# EAGLE design plugFeather (EAGLE 9.2.2)
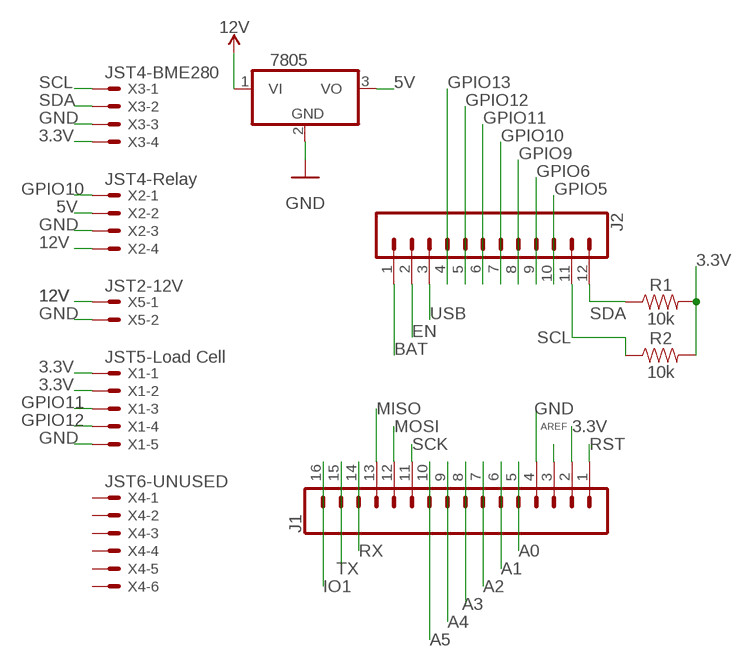
[diagram p0: schematic, sheet 1]

## Parts
IC1  7805  7805TV  [TO220V]
J1  CONN_16  [1X16]
J2  CONN_12  [1X12]
R1  10k  10KOHM-HORIZ-1/4W-5%  [AXIAL-0.3]
R2  10k  10KOHM-HORIZ-1/4W-5%  [AXIAL-0.3]
X1  JST5-Load Cell  JST-XH-05-PIN-LONG-PAD  [JST-XH-05-PACKAGE-LONG-PAD]
X2  JST4-Relay  JST-XH-04-PIN-LONG-PAD  [JST-XH-04-PACKAGE-LONG-PAD]
X3  JST4-BME280  JST-XH-04-PIN-LONG-PAD  [JST-XH-04-PACKAGE-LONG-PAD]
X4  JST6-UNUSED  JST-XH-06-PIN-LONG-PAD  [JST-XH-06-PACKAGE-LONG-PAD]
X5  JST2-12V  JST-XH-02-PIN-LONG-PAD  [JST-XH-02-PACKAGE-LONG-PAD]

## Nets
3.3V: J1.2 R1.P$2 R2.P$2 X1.1 X1.2 X3.4
5V: IC1.3(VO) X2.2
12V: IC1.1(VI) X2.4 X5.1
A0: J1.5
A1: J1.6
A2: J1.7
A3: J1.8
A4: J1.9
A5: J1.10
AREF: J1.3
BAT: J2.1
EN: J2.2
GND: IC1.2(GND) J1.4 X1.5 X2.3 X3.3 X5.2
GPIO5: J2.10
GPIO6: J2.9
GPIO9: J2.8
GPIO10: J2.7 X2.1
GPIO11: J2.6 X1.3
GPIO12: J2.5 X1.4
GPIO13: J2.4
IO1: J1.16
MISO: J1.13
MOSI: J1.12
RST: J1.1
RX: J1.14
SCK: J1.11
SCL: J2.11 R2.P$1 X3.1
SDA: J2.12 R1.P$1 X3.2
TX: J1.15
USB: J2.3
Unconnected: X4.1 X4.2 X4.3 X4.4 X4.5 X4.6

## Library data of the parts
IC1 = linear:78*: Positive VOLTAGE REGULATOR Source: http://cache.national.com/ds/LM/LM78L05.pdf http://www.fairchildsemi.com/ds/LM/LM7805.pdf
J1 = SparkFun-Connectors:CONN_16: Multi connection point. Often used as Generic Header-pin footprint for 0.1 inch spaced/style header connections On any of the 0.1 inch spaced packages, you can populate with these: Break Away Headers - Straight <https://www.sparkfun.com/products/116> (PRT-00116) Break Away Male Headers - Right Angle <https://www.sparkfun.com/products/553> (PRT-00553) Female Headers <https://www.sparkfun.com/products/115> (PRT-00115) Break Away Headers - Machine Pin <https://www.sparkfun.com/products/117> (PRT-00117) Break Away Female Headers - Swiss Machine Pin <https://www.sparkfun.com/products/743> (PRT-00743) For SCREWTERMINALS and SPRING TERMINALS visit here: Screw Terimnals on SparkFun.com <https://www.sparkfun.com/search/results?term=Screw+Terminals> (5mm/3.5mm/2.54mm spacing) This device is also useful as a general connection point to wire up your design to another part of your project. Our various solder wires solder well into these plated through hole pads. Hook-Up Wire - Assortment (Stranded, 22 AWG) <https://www.sparkfun.com/products/11375> (PRT-11375) Hook-Up Wire - Assortment (Solid Core, 22 AWG) <https://www.sparkfun.com/products/11367> (PRT-11367) View the entire wire category on our website here <https://www.sparkfun.com/categories/141> Special notes: Molex polarized connector foot print use with SKU : PRT-08231 with associated crimp pins and housings. 1MM SMD Version SKU: PRT-10208 NOTES ON THE VARIANTS LOCK and LOCK_LONGPADS... This footprint was designed to help hold the alignment of a through-hole component (i.e. 6-pin header) while soldering it into place. You may notice that each hole has been shifted either up or down by 0.005 of an inch from it's more standard position (which is a perfectly straight line). This slight alteration caused the pins (the squares in the middle) to touch the edges of the holes. Because they are alternating, it causes a "brace" to hold the component in place. 0.005 has proven to be the perfect amount of "off-center" position when using our standard breakaway headers. Although looks a little odd when you look at the bare footprint, once you have a header in there, the alteration is very hard to notice. Also,if you push a header all the way into place, it is covered up entirely on the bottom side.
J2 = SparkFun-Connectors:CONN_12: Multi connection point. Often used as Generic Header-pin footprint for 0.1 inch spaced/style header connections On any of the 0.1 inch spaced packages, you can populate with these: Break Away Headers - Straight <https://www.sparkfun.com/products/116> (PRT-00116) Break Away Male Headers - Right Angle <https://www.sparkfun.com/products/553> (PRT-00553) Female Headers <https://www.sparkfun.com/products/115> (PRT-00115) Break Away Headers - Machine Pin <https://www.sparkfun.com/products/117> (PRT-00117) Break Away Female Headers - Swiss Machine Pin <https://www.sparkfun.com/products/743> (PRT-00743) For SCREWTERMINALS and SPRING TERMINALS visit here: Screw Terimnals on SparkFun.com <https://www.sparkfun.com/search/results?term=Screw+Terminals> (5mm/3.5mm/2.54mm spacing) This device is also useful as a general connection point to wire up your design to another part of your project. Our various solder wires solder well into these plated through hole pads. Hook-Up Wire - Assortment (Stranded, 22 AWG) <https://www.sparkfun.com/products/11375> (PRT-11375) Hook-Up Wire - Assortment (Solid Core, 22 AWG) <https://www.sparkfun.com/products/11367> (PRT-11367) View the entire wire category on our website here <https://www.sparkfun.com/categories/141> Special notes: Molex polarized connector foot print use with SKU : PRT-08231 with associated crimp pins and housings. 1MM SMD Version SKU: PRT-10208 NOTES ON THE VARIANTS LOCK and LOCK_LONGPADS... This footprint was designed to help hold the alignment of a through-hole component (i.e. 6-pin header) while soldering it into place. You may notice that each hole has been shifted either up or down by 0.005 of an inch from it's more standard position (which is a perfectly straight line). This slight alteration caused the pins (the squares in the middle) to touch the edges of the holes. Because they are alternating, it causes a "brace" to hold the component in place. 0.005 has proven to be the perfect amount of "off-center" position when using our standard breakaway headers. Although looks a little odd when you look at the bare footprint, once you have a header in there, the alteration is very hard to notice. Also,if you push a header all the way into place, it is covered up entirely on the bottom side.
R1 R2 = SparkFun-Resistors:10KOHM: 10kΩ resistor A resistor is a passive two-terminal electrical component that implements electrical resistance as a circuit element. Resistors act to reduce current flow, and, at the same time, act to lower voltage levels within circuits. - Wikipedia; PROD_ID: RES-09435
X1 = JST XH Connectors v1-0:JST-XH-05-PIN: JST XH Connector 2 Pin Wire to board connector. Pitch: 2,54 mm, (0.100") Number of pins: 5 Created by Rembrandt Electronics www.rembrandtelectronics.com
X2 X3 = JST XH Connectors v1-0:JST-XH-04-PIN: JST XH Connector 2 Pin Wire to board connector. Pitch: 2,54 mm, (0.100") Number of pins: 4 Created by Rembrandt Electronics www.rembrandtelectronics.com
X4 = JST XH Connectors v1-0:JST-XH-06-PIN: JST XH Connector 2 Pin Wire to board connector. Pitch: 2,54 mm, (0.100") Number of pins: 6 Created by Rembrandt Electronics www.rembrandtelectronics.com
X5 = JST XH Connectors v1-0:JST-XH-02-PIN: JST XH Connector 2 Pin Wire to board connector. Pitch: 2,54 mm, (0.100") Number of pins: 2 Created by Rembrandt Electronics www.rembrandtelectronics.com

## Board
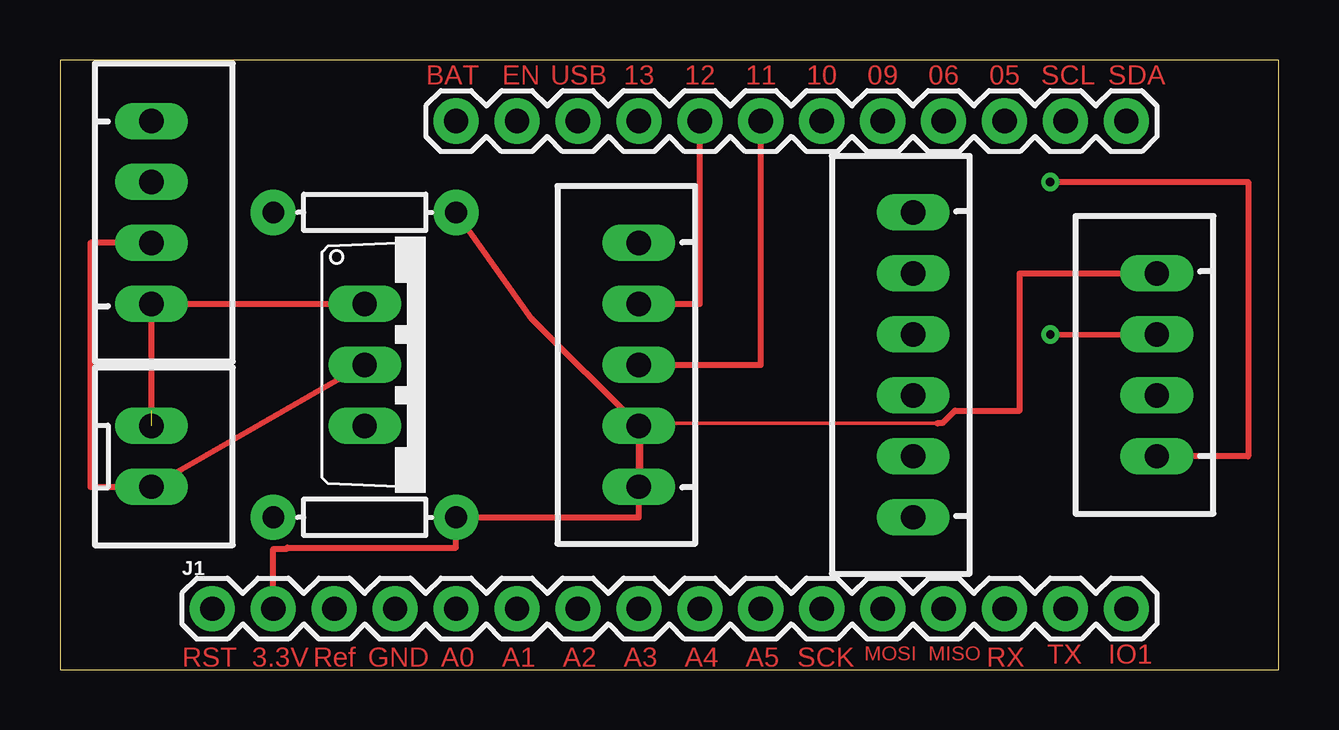
[diagram p1: board, top side]
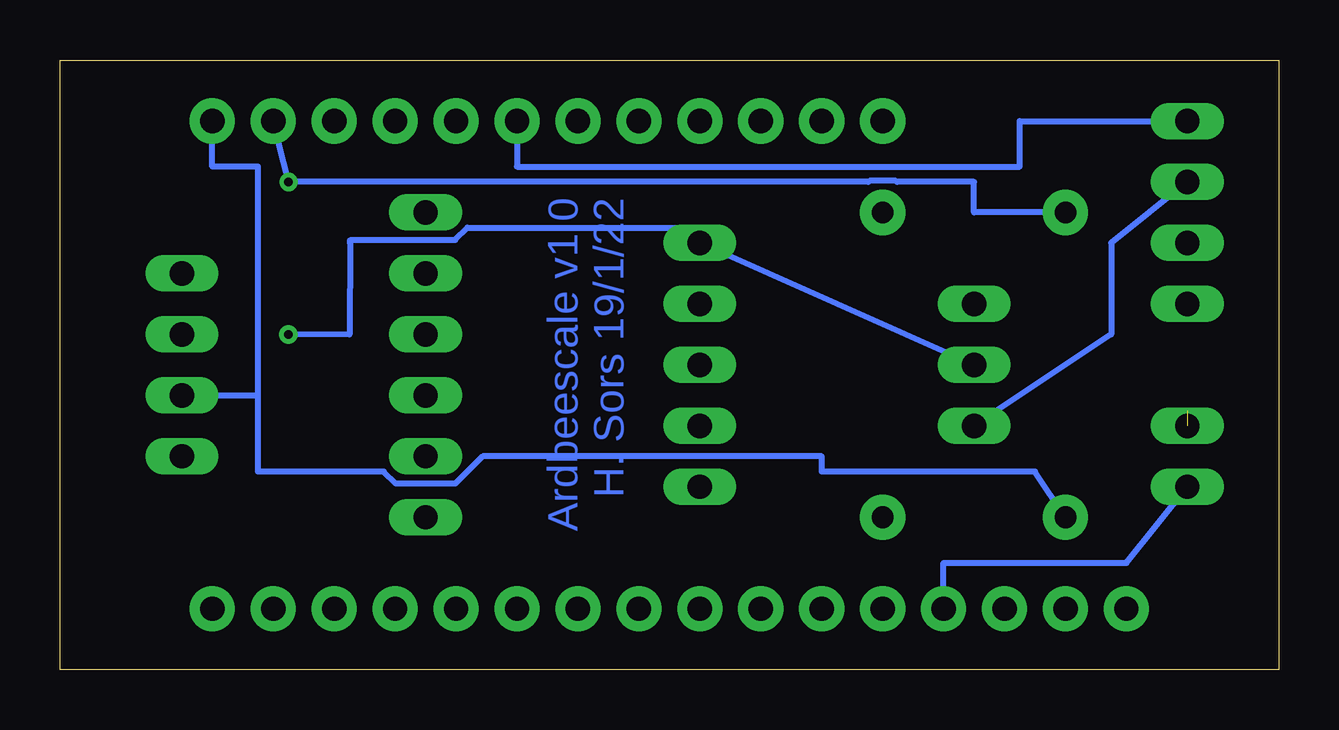
[diagram p2: board, bottom side, seen from below]

Size 50.8 x 25.4 mm. Coordinates in mm from the lower left corner, seen from the top.
Outline: 0,0 50.8,0.01 50.8,25.4 0,25.4 0,0
Copper layers (1*16): Top 0.035mm / dielectric 1.5mm / Bottom 0.035mm
Design rules "default *": minimum track width 10mil, minimum drill 0.35mm, track to track 6mil, track to pad 10mil, pad to pad 10mil, via to via 10mil, smd to smd 6mil, copper to edge 40mil, drill to drill 6mil, minimum pad ring 10mil, minimum via ring 8mil, stop-mask expansion 4mil, vias tented up to drill 0mil, thermal gap 10mil

### Footprints (pad centres in the part's own frame; a part is rotated, then mirrored left to right if it is on the bottom)
TO220V = drill 1.016 long: 1 -2.54,-2.54; 2 0,-2.54; 3 2.54,-2.54
1X16 = drill 1.016 pad 1.88: 1 0,0; 2 2.54,0; 3 5.08,0; 4 7.62,0; 5 10.16,0; 6 12.7,0; 7 15.24,0; 8 17.78,0; 9 20.32,0; 10 22.86,0; 11 25.4,0; 12 27.94,0; 13 30.48,0; 14 33.02,0; 15 35.56,0; 16 38.1,0
1X12 = drill 1.016 pad 1.88: 1 0,0; 2 2.54,0; 3 5.08,0; 4 7.62,0; 5 10.16,0; 6 12.7,0; 7 15.24,0; 8 17.78,0; 9 20.32,0; 10 22.86,0; 11 25.4,0; 12 27.94,0
AXIAL-0.3 = drill 0.9 pad 1.88: P$1 -3.81,0; P$2 3.81,0
JST-XH-05-PACKAGE-LONG-PAD = drill 1.016 long: 1 -5.08,0; 2 -2.54,0; 3 0,0; 4 2.54,0; 5 5.08,0
JST-XH-04-PACKAGE-LONG-PAD = drill 1.016 long: 1 -3.81,0; 2 -1.27,0; 3 1.27,0; 4 3.81,0
JST-XH-06-PACKAGE-LONG-PAD = drill 1.016 long: 1 -6.35,0; 2 -3.81,0; 3 -1.27,0; 4 1.27,0; 5 3.81,0; 6 6.35,0
JST-XH-02-PACKAGE-LONG-PAD = drill 1.016 long: 1 -1.27,0; 2 1.27,0

### Placement (x,y rotation side)
IC1  15.24,12.7 270 top
J1  6.35,2.54 0 top
J2  16.51,22.86 0 top
R1  12.7,6.35 0 top
R2  12.7,19.05 0 top
X1  24.13,12.7 90 top
X2  3.81,19.05 270 top
X3  45.72,12.7 90 top
X4  35.56,12.7 90 top
X5  3.81,8.89 270 top

### Tracks (layer width: path | path; a pad name or v marks a point on that pad's centre or on a via)
3.3V
  Top 0.152: 16.46,6.3 R1.P$2 | X1.1 24.23,7.67 24.23,10.11 X1.2 | 42.82,16.51 X3.4 | 36.58,10.26 24.23,10.26 X1.2 | 24.08,10.26 X1.2
  Top 0.254: 36.58,10.26 36.6,10.29 36.8,10.29 37.3,10.79 40.01,10.79 40.01,16.51 X3.4 | 24.23,10.26 24.13,10.26 X1.1 24.13,6.35 R1.P$2 16.51,5.08 9.49,5.08 9.44,5.03 8.89,5.03 J1.2 | X1.2 19.68,14.61 R2.P$2
5V
  Bottom 0.254: X2.2 6.99,17.78 6.99,13.97 IC1.3
12V  (1 unrouted)
  Top 0.152: 12.65,15.29 IC1.1 | 3.81,15.29 X2.4
  Top 0.254: 3.81,10.79 X2.4 IC1.1
GND  (via drill 0.35)
  Top 0.152: 12.65,12.7 IC1.2 | 3.81,7.67 X5.2
  Top 0.254: v41.28,13.96 X3.3 | 12.65,12.7 X5.2 1.27,7.62 1.27,17.78 X2.3
  Bottom 0.152: 45.72,14.07 X3.3
  Bottom 0.254: v41.28,13.96 38.73,13.97 38.71,17.78 38.71,17.88 38.68,17.91 34.33,17.91 33.82,18.41 24.13,18.41 X1.5 IC1.2 | J1.4 13.97,4.45 6.35,4.45 X5.2
GPIO10
  Bottom 0.254: J2.7 31.75,20.95 10.79,20.95 10.79,22.86 X2.1
GPIO11
  Top 0.254: X1.3 29.21,12.7 J2.6
GPIO12
  Top 0.254: X1.4 26.67,15.24 J2.5
SCL  (via drill 0.35)
  Top 0.254: v41.27,20.32 49.53,20.32 49.53,8.89 X3.1
  Bottom 0.254: R2.P$1 12.7,19.05 12.7,20.32 15.91,20.32 15.96,20.37 17.06,20.37 17.11,20.32 v41.27,20.32 J2.11
SDA
  Bottom 0.152: 44.81,11.43 X3.2
  Bottom 0.254: R1.P$1 10.16,8.26 19.05,8.26 19.05,8.89 33.18,8.89 34.33,7.75 36.8,7.75 37.3,8.26 42.55,8.26 42.55,11.43 | 42.55,11.43 42.55,20.95 44.45,20.95 J2.12 | X3.2 42.55,11.43

### Text on the board
Top: BAT | EN | USB | 13 | 12 | 11 | 10 | 09 | 06 | 05 | SCL | SDA | RST | 3.3V | Ref | GND | A0 | A1 | A2 | A3 | A4 | A5 | SCK | MOSI | MISO | RX | TX | IO1
Bottom: Ardbeescale v1.0 / H. Sors 19/1/22